# EAGLE design Qwiic Distance Sensor - VL53L1X (EAGLE 9.6.2)
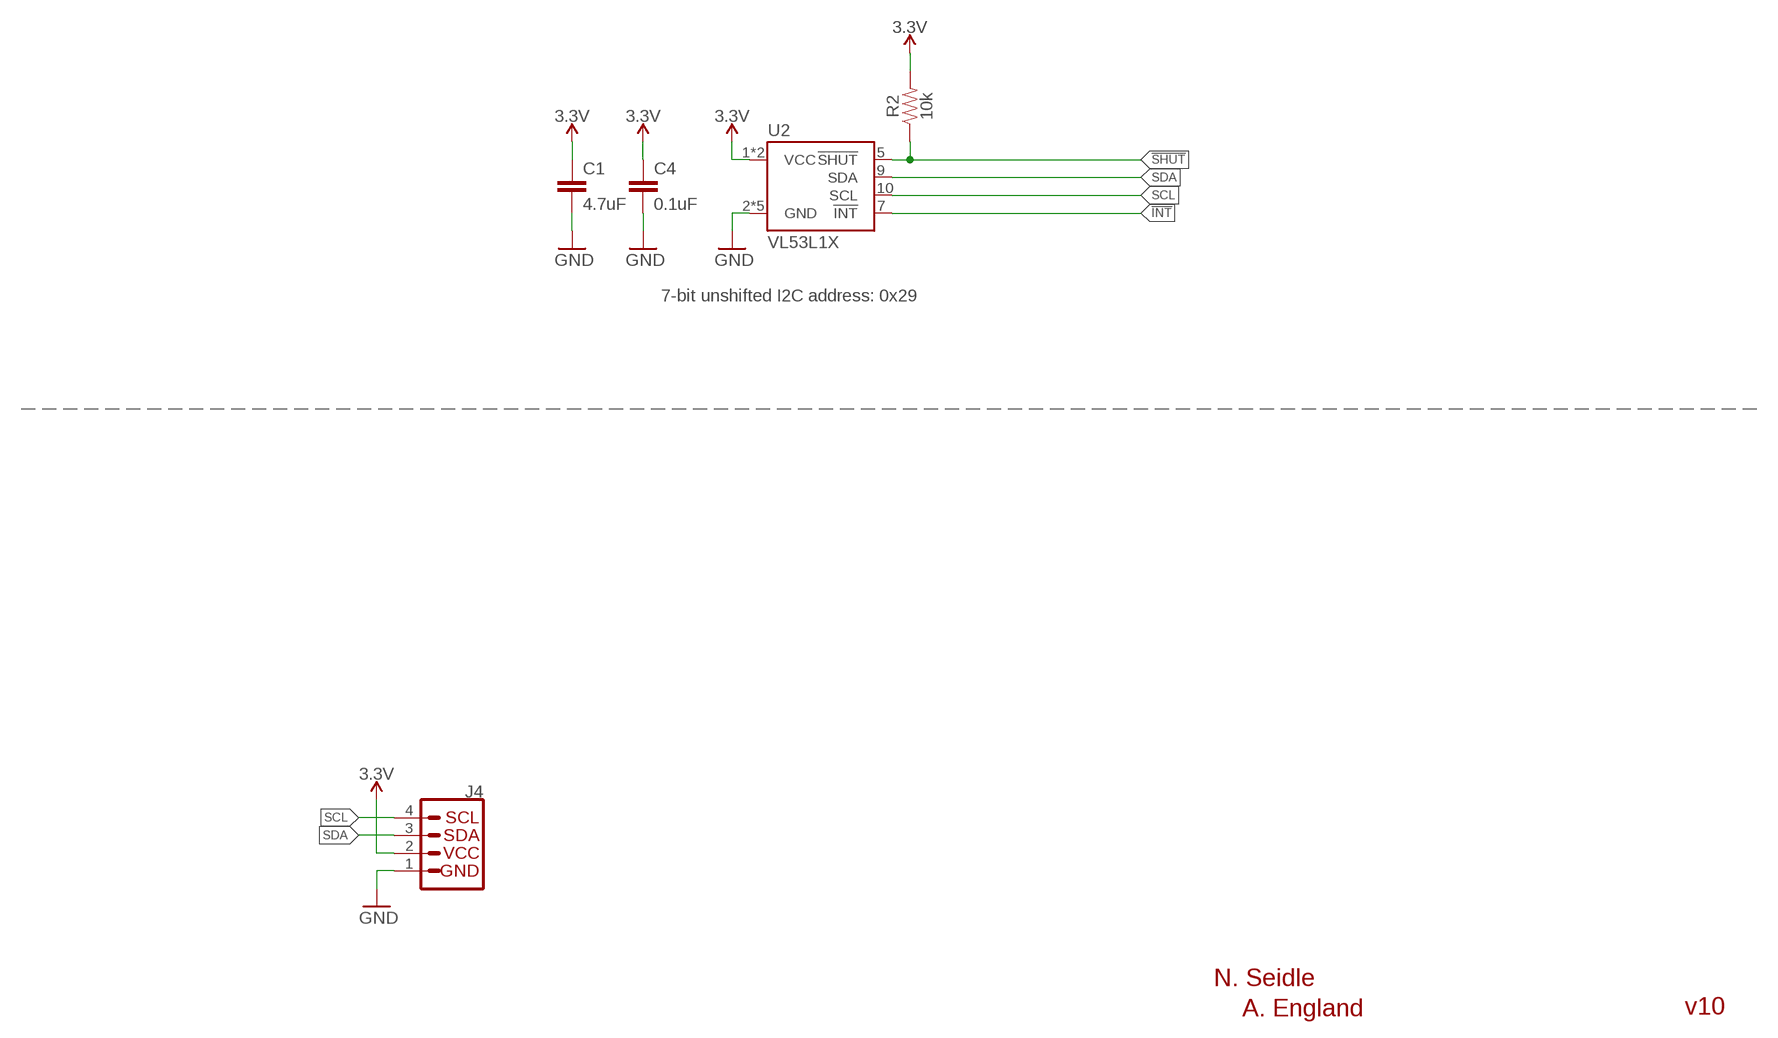
[diagram p0: schematic, sheet 1]

## Parts
C1  4.7uF  4.7UF0603  [0603]
C4  0.1uF  0.1UF-0603-25V-(+80/-20%)  [0603]
J4  QWIIC_CONNECTORJS-1MM  [1X04_1MM_RA]
R2  10k  10KOHM-0603-1/10W-1%  [0603]
U2  VL53L1X  VL53L1XSMD  [VL53L1X]

## Nets
3.3V: C1.1 C4.1 J4.2 R2.2 U2.1(VCC) U2.11(VCC)
!INT: U2.7(!INT)
!SHUT: R2.1 U2.5(!SHUT)
GND: C1.2 C4.2 J4.1 U2.2(GND) U2.3(GND) U2.4(GND) U2.6(GND) U2.12(GND)
SCL: J4.4 U2.10(SCL)
SDA: J4.3 U2.9(SDA)

## Notes on the sheet
- 7-bit unshifted I2C address: 0x29
- N. Seidle
- A. England | v10

## Library data of the parts
C1 = SparkFun-Capacitors:4.7UF: 4.7µF ceramic capacitors A capacitor is a passive two-terminal electrical component used to store electrical energy temporarily in an electric field.; PROD_ID: CAP-08280
C4 = SparkFun-Capacitors:0.1UF: 0.1µF ceramic capacitors A capacitor is a passive two-terminal electrical component used to store electrical energy temporarily in an electric field.; PROD_ID: CAP-00810
J4 = SparkFun-Connectors:QWIIC_CONNECTOR: SparkFun I2C Standard Qwiic Connector An SMD 1mm pitch JST connector makes it easy and quick (get it? Qwiic?) to connect I2C devices to each other. The Qwiic system <http://www.sparkfun.com/qwiic> enables fast and solderless connection between popular platforms and various sensors and actuators. We carry 200mm <https://www.sparkfun.com/products/14204>, 100mm <https://www.sparkfun.com/products/14205>, 50mm <https://www.sparkfun.com/products/14206>, and breadboard friendly <https://www.sparkfun.com/products/14207> Qwiic cables. We also offer 10 pcs strips <https://www.sparkfun.com/products/14323> the SMD connectors.; PROD_ID: CONN-13694
R2 = SparkFun-Resistors:10KOHM: 10kΩ resistor A resistor is a passive two-terminal electrical component that implements electrical resistance as a circuit element. Resistors act to reduce current flow, and, at the same time, act to lower voltage levels within circuits. - Wikipedia; PROD_ID: RES-00824
U2 = SparkFun-Sensors:VL53L1X: STMicroelectronics VL53L1X - 400 cm IR Laser ToF Sensor VL53L1X is a state-of-the-art ToF laser-ranging sensor, enhancing the ST FlightSense product family. It is the fastest miniature ToF sensor currently on the market with accurate ranging up to 4 m and fast ranging frequency (up to 50 Hz). Housed in a miniature and reflowable package, it integrates a single photon avalanche diode (SPAD) receiving array, a 940 nm invisible laser Class 1 emitter, physical infrared filters, and optics to achieve the best ranging performance in various ambient lighting conditions with a range of cover window options.; PROD_ID: IC-13960

## Net classes
1 power: width 0.203 mm

## Board
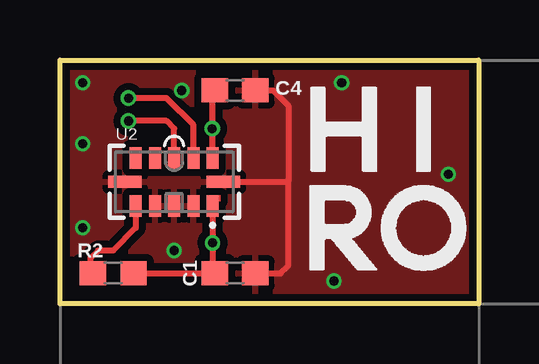
[diagram p1: board, top side]
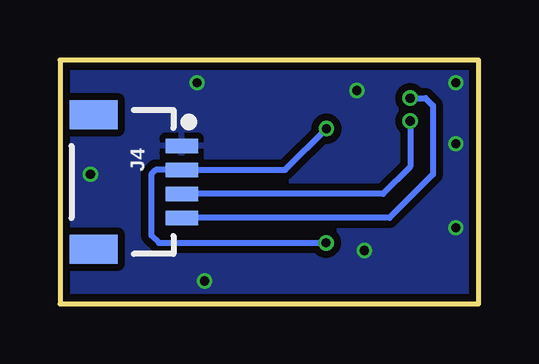
[diagram p2: board, bottom side, seen from below]

Size 17.46 x 10.16 mm. Coordinates in mm from the lower left corner, seen from the top.
Outline: 0,0 0,10.16 17.46,10.16 17.46,0 0,0
Copper layers (1*16): Top 0.035mm / dielectric 1.5mm / Bottom 0.035mm
Design rules "SparkFun-2-layer-FAB-LIMIT": minimum track width 4mil, minimum drill 6mil, track to track 4mil, track to pad 4mil, pad to pad 4mil, via to via 4mil, smd to smd 4mil, copper to edge 4mil, drill to drill 4mil, minimum pad ring 5mil, minimum via ring 5mil, stop-mask expansion 4mil, vias tented up to drill 25mil, thermal gap 10mil

### Footprints (pad centres in the part's own frame; a part is rotated, then mirrored left to right if it is on the bottom)
0603 = smd 1.1 x 1: 1 -0.85,0; 2 0.85,0
1X04_1MM_RA = smd 0.6 x 1.35: 1 -1.5,0; 2 -0.5,0; 3 0.5,0; 4 1.5,0 | smd 1.2 x 2: NC1 2.8,-3.675; NC2 -2.8,-3.675
VL53L1X = smd 0.5 x 0.9: 1 1.6,-1; 2 0.8,-1; 3 0,-1; 4 -0.8,-1; 5 -1.6,-1; 7 -1.6,1; 8 -0.8,1; 9 0,1; 10 0.8,1; 11 1.6,1 | smd 1.4 x 0.5: 6 -2.05,0; 12 2.05,0

### Placement (x,y rotation side)
C1  7.3,1.27 0 top
C4  7.3,8.89 0 top
J4  12.38,5.08 270 bottom
R2  2.22,1.27 0 top
U2  4.76,5.08 0 top
U$1  [HIRO#PNG]  13.34,5.4 0 top

### Tracks (layer width: path | path; a pad name or v marks a point on that pad's centre or on a via)
3.3V  (via drill 0.38)
  Top 0.254: U2.11 6.36,7.3 | 6.36,7.3 6.36,8.8 C4.1 | v6.35,7.3 6.36,7.3 | R2.2 C1.1 6.36,1.36 v6.36,2.54 U2.1
  Bottom 0.254: v6.35,7.3 8.07,5.58 J4.2 13.47,5.58 13.65,5.4 13.65,2.86 13.34,2.54 v6.36,2.54
!SHUT
  Top 0.254: U2.5 3.16,3.16 2.22,2.22 1.59,2.22 1.27,1.91 1.27,1.37 R2.1
GND  (via drill 0.38)
  Top 0.254: 9.53,5.08 9.53,1.59 9.21,1.27 C1.2 | C4.2 8.89,8.89 9.53,8.25 9.53,5.08 | U2.12 9.53,5.08
  other vias: 0.95,3.17 4.76,2.22 0.95,6.67 0.95,9.21 5.08,8.89 11.75,9.21 16.19,5.4 11.43,0.95
  pour Bottom (isolate 0.305): 0,0 0,10.16 17.46,10.16 17.46,0
  pour Top (isolate 0.305): 0,0 0,10.16 17.46,10.16 17.46,0
SCL  (via drill 0.38)
  Top 0.254: U2.10 5.56,7.45 4.45,8.57 v2.86,8.57
  Bottom 0.254: v2.86,8.57 2.22,8.57 1.91,8.25 1.91,5.4 3.72,3.58 J4.4
SDA  (via drill 0.38)
  Top 0.254: U2.9 4.76,7.3 4.45,7.62 v2.86,7.62
  Bottom 0.254: v2.86,7.62 2.86,5.72 3.99,4.58 J4.3